# EAGLE design speaker-board (EAGLE 7.7.0)
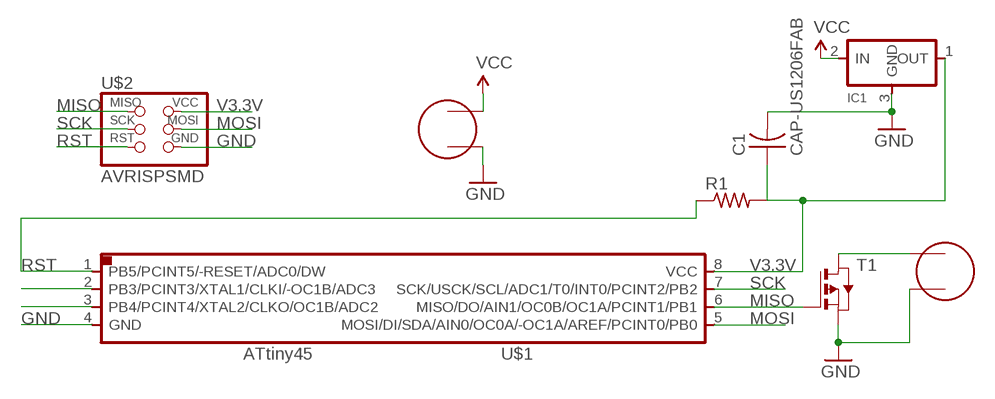
[diagram p0: schematic, sheet 1]

## Parts
C1  CAP-US1206FAB  [C1206FAB]
IC1  REGULATORSOT23  [SOT23]
R1  RES-US1206FAB  [R1206FAB]
T1  PMOSFETSOT23  [SOT-23]
U$1  ATTINY45SI  [SOIC8]
U$2  AVRISPSMD  [2X03SMD]
U$3  PINHD-2X1-SMD  [2X01SMD]
U$4  PINHD-2X1-SMD  [2X01SMD]

## Nets
GND: C1.2 IC1.3(GND) T1.2(S) U$1.4(GND) U$2.6(GND) U$3.4 U$4.3
MISO: T1.3(G) U$1.6(MISO/DO/AIN1/OC0B/OC1A/PCINT1/PB1) U$2.1(MISO)
MOSI: U$1.5(MOSI/DI/SDA/AIN0/OC0A/-OC1A/AREF/PCINT0/PB0) U$2.4(MOSI)
N$1: T1.1(D) U$3.3
N$12: U$1.2(PB3/PCINT3/XTAL1/CLKI/-OC1B/ADC3)
N$13: U$1.3(PB4/PCINT4/XTAL2/CLKO/OC1B/ADC2)
RST: R1.1 U$1.1(PB5/PCINT5/-RESET/ADC0/DW) U$2.5(RST)
SCK: U$1.7(SCK/USCK/SCL/ADC1/T0/INT0/PCINT2/PB2) U$2.3(SCK)
V3.3V: C1.1 IC1.1(OUT) R1.2 U$1.8(VCC) U$2.2(VCC)
VCC: IC1.2(IN) U$4.4

## Library data of the parts
C1 = fab-library:CAP-US
IC1 = fab-library:REGULATOR
R1 = fab-library:RES-US: Resistor (US Symbol) Variants with postfix FAB are widened to allow the routing of internal traces
T1 = fab-library:PMOSFET: MOS FET
U$1 = fab-library:ATTINY45
U$2 = fab-library:AVRISP
U$3 U$4 = fab-library:PINHD-2X1-SMD

## Board
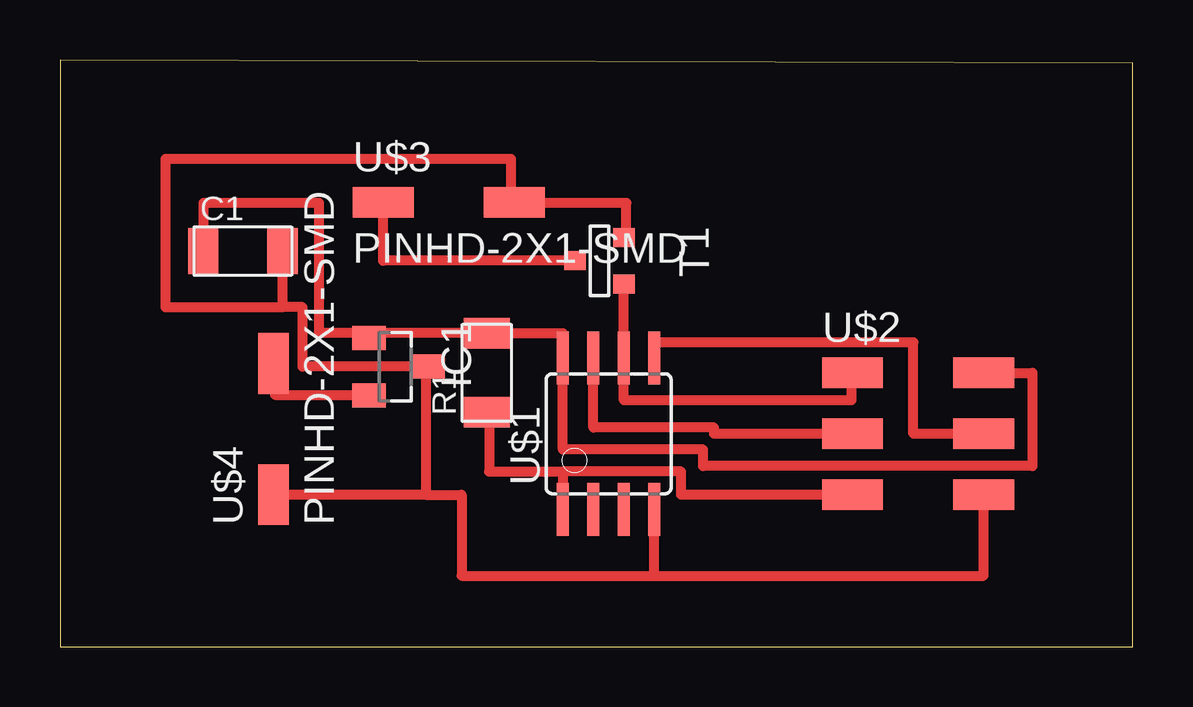
[diagram p1: board, top side]

Size 44.7 x 24.48 mm. Coordinates in mm from the lower left corner, seen from the top.
Outline: 0,0 44.7,0 44.7,24.35 0,24.48 0,0
Copper layers (1*16): Top 0.035mm / dielectric 1.5mm / Bottom 0.035mm
Design rules "default": minimum track width 10mil, minimum drill 24mil, track to track 8mil, track to pad 8mil, pad to pad 8mil, via to via 8mil, smd to smd 8mil, copper to edge 40mil, drill to drill 8mil, minimum pad ring 10mil, minimum via ring 8mil, stop-mask expansion 4mil, vias tented up to drill 0mil, thermal gap 10mil

### Footprints (pad centres in the part's own frame; a part is rotated, then mirrored left to right if it is on the bottom)
C1206FAB = smd 1.27 x 1.905: 1 -1.651,0; 2 1.651,0
SOT23 = smd 1 x 1.4: 1 -1.204,-1.1; 2 1.204,-1.1; 3 0,1.354
R1206FAB = smd 1.27 x 1.905: 1 -1.651,0; 2 1.651,0
SOT-23 = smd 0.787 x 0.889: 1 0.025,-1.016; 2 -0.94,1.016; 3 0.991,1.016
SOIC8 = smd 0.5 x 2.2: 1 -1.905,-3.154; 2 -0.645,-3.154; 3 0.625,-3.154; 4 1.895,-3.154; 5 1.905,3.154; 6 0.635,3.154; 7 -0.635,3.154; 8 -1.905,3.154
2X03SMD = smd 2.54 x 1.27: 1 -2.54,2.54; 2 2.92,2.54; 3 -2.54,0; 4 2.92,0; 5 -2.54,-2.54; 6 2.92,-2.54
2X01SMD = smd 2.54 x 1.27: 3 -2.54,-1.27; 4 2.92,-1.27

### Placement (x,y rotation side)
C1  7.62,16.51 0 top
IC1  13.97,11.68 270 top
R1  17.78,11.43 90 top
T1  22.48,16.13 270 top
U$1  22.86,8.89 0 top
U$2  35.56,8.89 0 top
U$3  16,19.81 0 top
U$4  7.62,8.89 90 top

### Tracks (layer width: path | path; a pad name or v marks a point on that pad's centre or on a via)
GND
  Top 0.406: T1.2 23.6,17.07 23.6,18.52 18.92,18.52 U$3.4 18.8,18.54 18.8,20.34 4.39,20.34 4.39,14.17 9.27,14.17 | 15.24,6.35 15.24,11.68 IC1.3 10.11,11.68 10.11,14.17 9.27,14.17 | 15.24,6.35 U$4.3 | 9.27,14.17 C1.2 | 15.24,6.35 16.74,6.35 16.74,2.97 24.74,2.97 | 24.74,2.97 24.75,2.97 | 24.75,2.97 U$1.4 24.74,2.97 | 24.75,2.97 38.48,2.97 U$2.6
MISO
  Top 0.406: U$2.1 32.97,11.43 32.97,10.29 23.5,10.29 U$1.6 T1.3
MOSI
  Top 0.406: U$2.4 35.56,8.89 35.56,12.7 24.77,12.7 U$1.5
N$1
  Top 0.406: T1.1 13.46,16.1 U$3.3
RST
  Top 0.406: U$2.5 25.88,6.35 25.88,7.32 20.95,7.32 | 20.95,7.32 U$1.1 | R1.1 17.88,9.78 17.88,7.32 20.95,7.32
SCK
  Top 0.406: U$2.3 27.25,8.89 27.25,9.14 22.23,9.14 U$1.7
V3.3V
  Top 0.406: U$2.2 40.51,11.43 40.51,7.54 26.8,7.54 26.8,8.23 20.95,8.23 U$1.8 20.95,13.08 R1.2 12.87,13.08 | 12.87,13.08 IC1.1 | 12.87,13.08 10.79,13.08 10.79,18.52 5.97,18.52 C1.1
VCC
  Top 0.406: U$4.4 8.97,11.81 8.97,10.52 12.87,10.52 IC1.2